# Altium schematic sheet W5500.SchDoc
size A3; SheetNumber: 3; SheetTotal: 8
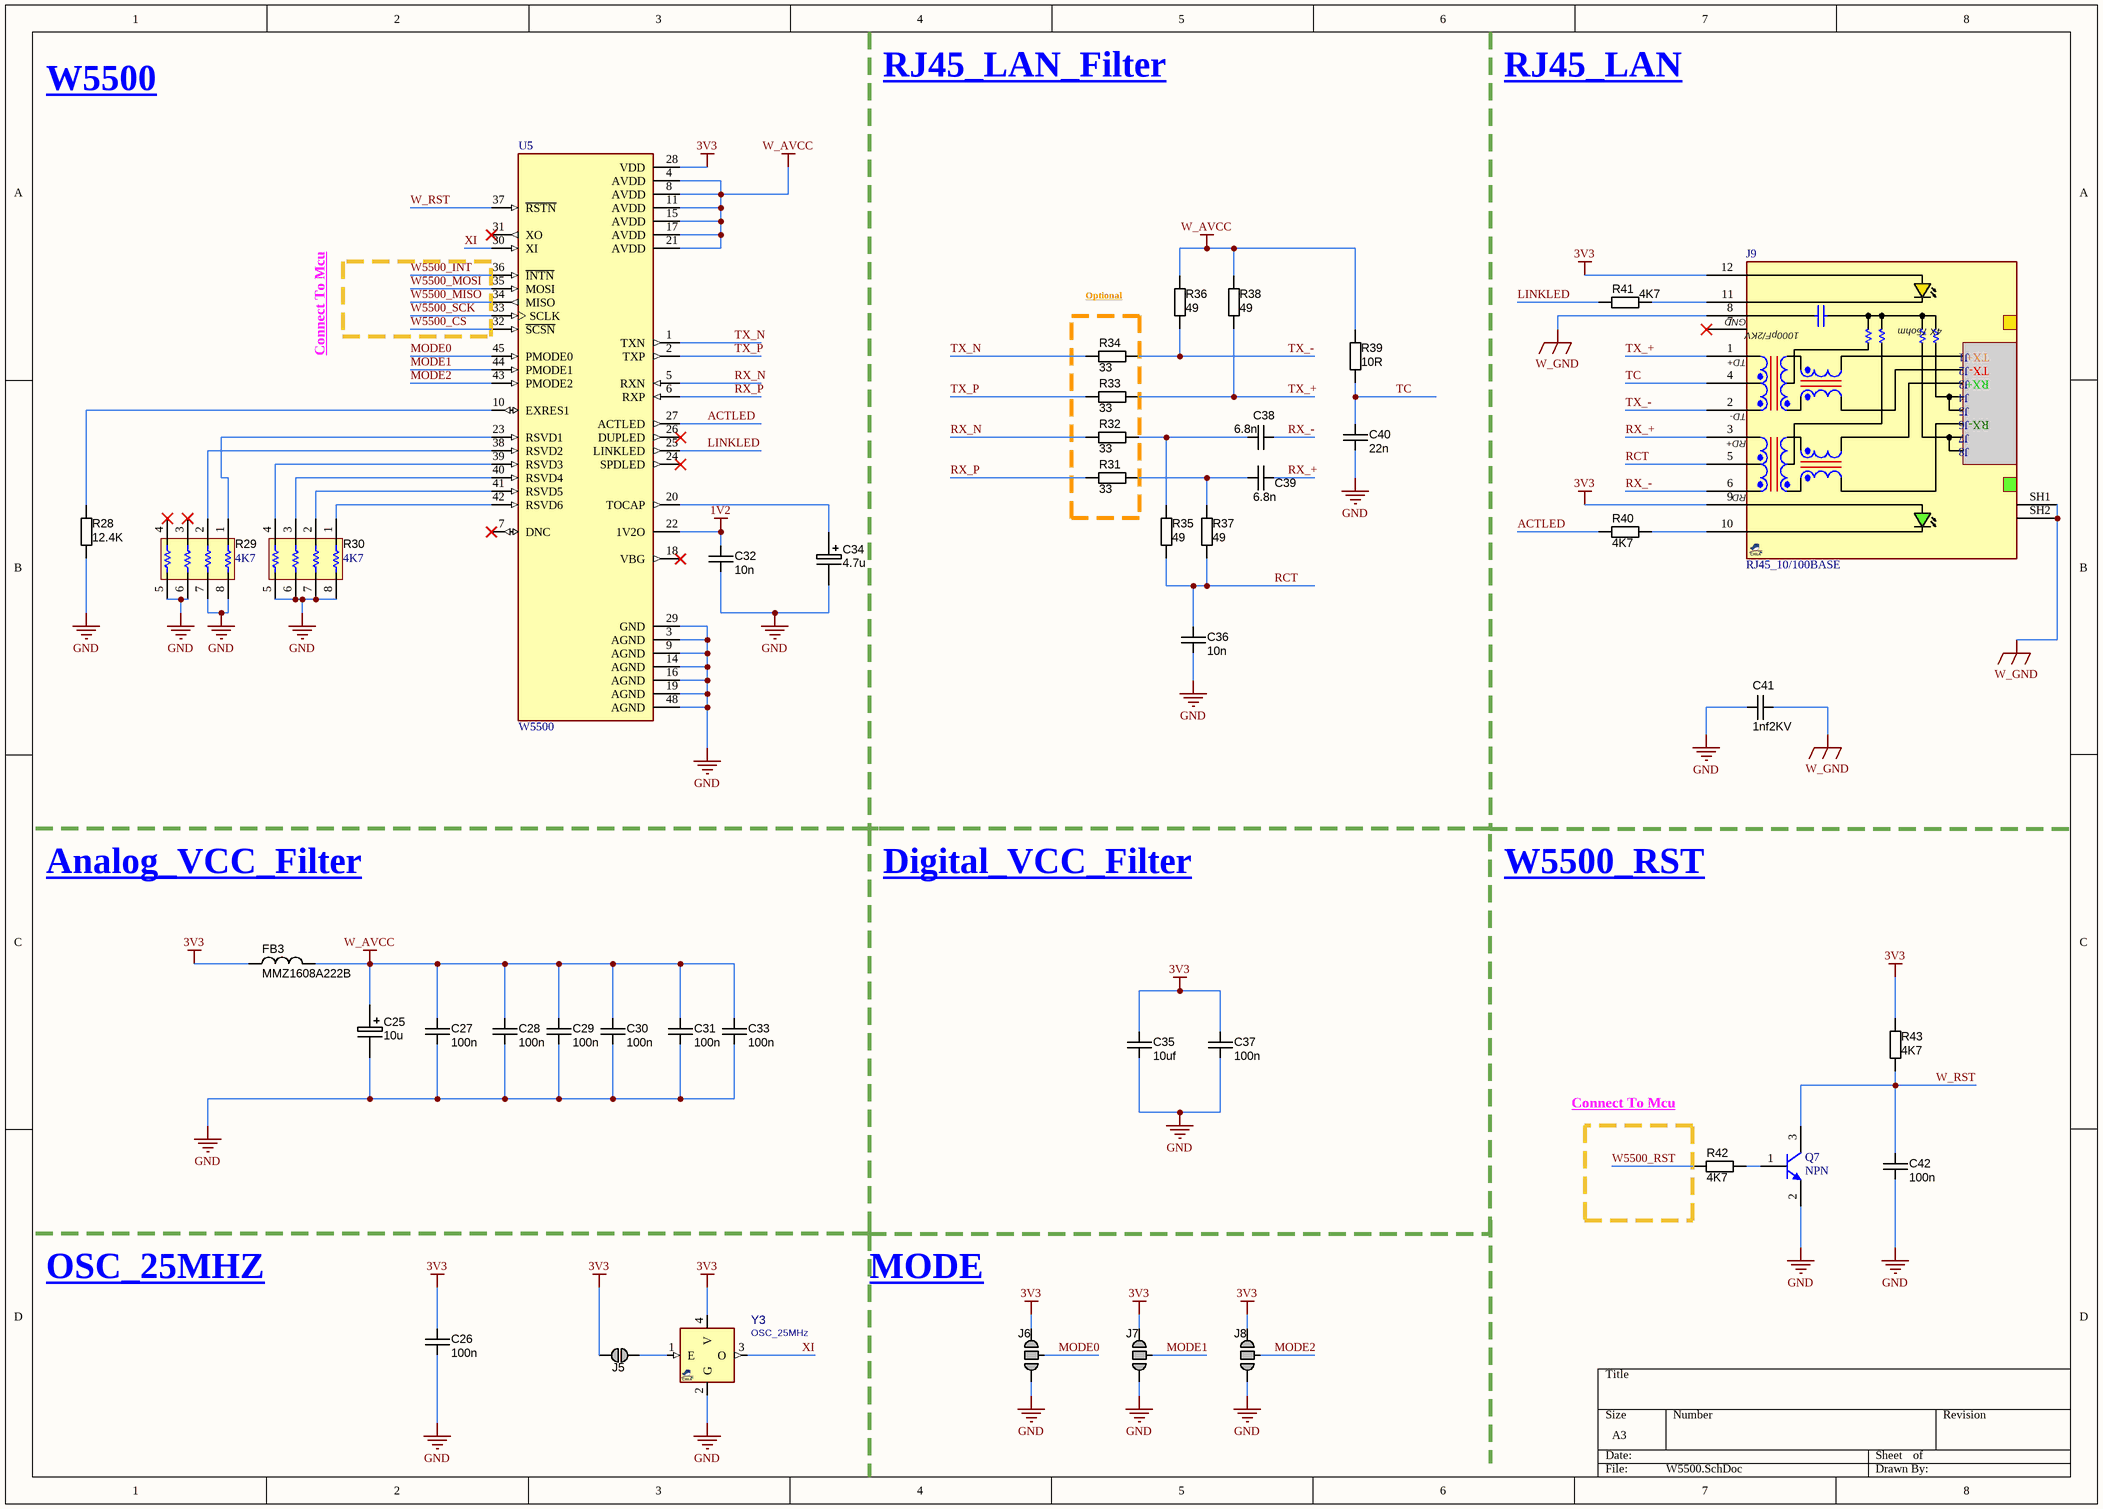
[diagram p0: W5500.SchDoc]

## Parts
C25  value 10u  [C_TN_3216]
C26  value 100n  [CAPC1608X90N]  (hidden comment: approved sub OK)
C27  value 100n  [CAPC1608X90N]  (hidden comment: approved sub OK)
C28  value 100n  [CAPC1608X90N]  (hidden comment: approved sub OK)
C29  value 100n  [CAPC1608X90N]  (hidden comment: approved sub OK)
C30  value 100n  [CAPC1608X90N]  (hidden comment: approved sub OK)
C31  value 100n  [CAPC1608X90N]  (hidden comment: approved sub OK)
C32  value 10n  [CAPC1608X90N]  (hidden comment: approved sub OK)
C33  value 100n  [CAPC1608X90N]  (hidden comment: approved sub OK)
C34  value 4.7u  [C_TN_3216]
C35  value 10uf  [CAPC1608X90N]  (hidden comment: approved sub OK)
C36  value 10n  [CAPC1608X90N]  (hidden comment: approved sub OK)
C37  value 100n  [CAPC1608X90N]  (hidden comment: approved sub OK)
C38  value 6.8n  [CAPC1608X90N]  (hidden comment: approved sub OK)
C39  value 6.8n  [CAPC1608X90N]  (hidden comment: approved sub OK)
C40  value 22n  [CAPC1608X90N]  (hidden comment: approved sub OK)
C41  value 1nf2KV  [C1206]  (hidden comment: approved sub OK)
C42  value 100n  [CAPC1608X90N]  (hidden comment: approved sub OK)
FB3  Manufacturer Part Number 1: MMZ1608A222B  [FBC1608X95N]  (hidden comment: 2K2 @ 100 MHz)
J5  Jumper  [JUMP1]  (value not drawn)  (no BOM)
J6  Jumper  [Jump_3Way]  (value not drawn)  (no BOM)
J7  Jumper  [Jump_3Way]  (value not drawn)  (no BOM)
J8  Jumper  [Jump_3Way]  (value not drawn)  (no BOM)
J9  RJ45_10/100BASE  [RJ45_8M_HR911105A]
Q7  NPN  [SOT23-3]
R28  value 12.4K  [RESC1608X55N]  (hidden comment: Thick Film)
R29  value 4K7  [RP0603X4]  (hidden comment: Resistor Array SMD)
R30  value 4K7  [RP0603X4]  (hidden comment: Resistor Array SMD)
R31  value 33  [RESC1608X55N]  (hidden comment: Thick Film)
R32  value 33  [RESC1608X55N]  (hidden comment: Thick Film)
R33  value 33  [RESC1608X55N]  (hidden comment: Thick Film)
R34  value 33  [RESC1608X55N]  (hidden comment: Thick Film)
R35  value 49  [RESC1608X55N]  (hidden comment: Thick Film)
R36  value 49  [RESC1608X55N]  (hidden comment: Thick Film)
R37  value 49  [RESC1608X55N]  (hidden comment: Thick Film)
R38  value 49  [RESC1608X55N]  (hidden comment: Thick Film)
R39  value 10R  [RESC1608X55N]  (hidden comment: Thick Film)
R40  value 4K7  [RESC1608X55N]  (hidden comment: Thick Film)
R41  value 4K7  [RESC1608X55N]  (hidden comment: Thick Film)
R42  value 4K7  [RESC1608X55N]  (hidden comment: Thick Film)
R43  value 4K7  [RESC1608X55N]  (hidden comment: Thick Film)
U5  W5500  [LQFP-48_N]
Y3  OSC_25MHz  [XTL_4_2520]

## Blocks framed on the sheet
Optional: R31-R34

## Nets
1V2: C32.1 U5.22(1V2O)
3V3: C26.1 C35.1 C37.1 FB3.1 J5.2 J6.3 J7.3 J8.3 J9.9(GLED+) J9.12(YLED+) R43.1 U5.28(VDD) Y3.4(V)
GND: C25.2 C26.2 C27.2 C28.2 C29.2 C30.2 C31.2 C32.2 C33.2 C34.2 C35.2 C36.2 C37.2 C40.2 C41.1 C42.2 J6.1 J7.1 J8.1 Q7.2(E) R28.1 R29.5 R29.6 R29.7 R29.8 R30.5 R30.6 R30.7 R30.8 U5.3(AGND) U5.9(AGND) U5.14(AGND) U5.16(AGND) U5.19(AGND) U5.29(GND) U5.48(AGND) Y3.2(G)
W_AVCC: C25.1 C27.1 C28.1 C29.1 C30.1 C31.1 C33.1 FB3.2 R36.2 R38.2 R39.2 U5.4(AVDD) U5.8(AVDD) U5.11(AVDD) U5.15(AVDD) U5.17(AVDD) U5.21(AVDD)
W_GND: C41.2 J9.8(CHSGND) J9.SH1 J9.SH2
ACTLED: R40.1 U5.27(ACTLED)
LINKLED: R41.1 U5.25(LINKLED)
MODE0: J6.2 U5.45(PMODE0)
MODE1: J7.2 U5.44(PMODE1)
MODE2: J8.2 U5.43(PMODE2)
RCT: C36.1 J9.5(RCT) R35.1 R37.1
RX_+: C39.2 J9.3(RD+)
RX_-: C38.2 J9.6(RD-)
RX_N: R32.1 U5.5(RXN)
RX_P: R31.1 U5.6(RXP)
TC: C40.1 J9.4(TCT) R39.1
TX_+: J9.1(TD+) R33.2 R38.1
TX_-: J9.2(TD-) R34.2 R36.1
TX_N: R34.1 U5.1(TXN)
TX_P: R33.1 U5.2(TXP)
W5500_CS: U5.32(~{SCSN})
W5500_INT: U5.36(~{INTN})
W5500_MISO: U5.34(MISO)
W5500_MOSI: U5.35(MOSI)
W5500_RST: R42.1
W5500_SCK: U5.33(SCLK)
W_RST: C42.1 Q7.3(C) R43.2 U5.37(~{RSTN})
XI: U5.30(XI) Y3.3(O)
NetC34_1: C34.1 U5.20(TOCAP)
NetC38_1: C38.1 R32.2 R35.2
NetC39_1: C39.1 R31.2 R37.2
NetJ5_1: J5.1 Y3.1(E)
NetJ9_10: J9.10(GLED-) R40.2
NetJ9_11: J9.11(YLED-) R41.2
NetQ7_1: Q7.1(B) R42.2
NetR28_2: R28.2 U5.10(EXRES1)
NetR29_1: R29.1 U5.23(RSVD1)
NetR29_2: R29.2 U5.38(RSVD2)
NetR30_1: R30.1 U5.42(RSVD6)
NetR30_2: R30.2 U5.41(RSVD5)
NetR30_3: R30.3 U5.40(RSVD4)
NetR30_4: R30.4 U5.39(RSVD3)

Not connected (* = marked no-connect by the designer): J9 7(NC)*; R29 3* 4*; U5 7(DNC)* 18(VBG)* 24(SPDLED)* 26(DUPLED)* 31(XO)*

## Notes on the sheet
- W5500
- RJ45_LAN_Filter
- RJ45_LAN
- Connect To Mcu
- Analog_VCC_Filter
- Digital_VCC_Filter
- W5500_RST
- OSC_25MHZ
- MODE
- (in symbol RJ45_HR911105A) GND; 4X 75ohm; 1000pF/2KV; J1; TX+; J2; TX-; J3; RX+; J4; J5; J6; RX-; J7; J8

## Library data of the parts
C25 = CAPT_4u7_3216_16V: Capacitor SMD Tantalum 10uF 10% 16V 3216-18; Manufacturer 1: Vishay/Sprague; Manufacturer Part Number 1: 293D475X9016A2TE3; SCDType: undef; Package / Case: EIA 535BAAC size A; Ratings: 16V; Tolerance: ±10%; Material: Tantalum; Supplier 1: Digi-Key; Supplier Part Number 1: 718-1148-1-ND
C26-C31 C33 C35-C37 C40 C42 = CAPC_100n_0603_X7R_50V_10%: Capacitor SMD Cer 100nF 10% 50V X7R 0603; Manufacturer 1: AVX Corporation; Manufacturer Part Number 1: 06035C104KAT2A; Ratings: 50V; X7R; Material: ceramic; SCDType: spec; Manufacturer 2: TDK Corporation; Manufacturer Part Number 2: C1608X7R1H104K; Package / Case: 0603 (1608 Metric); Tolerance: ±10%; Supplier 1: Digi-Key; Supplier Part Number 1: 478-5052-1-ND; ComponentLink1URL: http://www.avx.com/docs/Catalogs/cx7r.pdf; ComponentLink1Description: http://www.avx.com/docs/Catalogs/cx7r.pdf; Supplier 2: Digi-Key; Supplier Part Number 2: 445-1314-1-ND; ComponentLink2URL: http://product.tdk.com/capacitor/mlcc/en/documents/mlcc_commercial_general_en.pdf; ComponentLink2Description: http://product.tdk.com/capacitor/mlcc/en/documents/mlcc_commercial_general_en.pdf
C32 = CAPC_100n_0603_X7R_50V_10%: Capacitor SMD Cer 10nF 10% 50V X7R 0603; Manufacturer 1: AVX Corporation; Manufacturer Part Number 1: 06035C104KAT2A; Ratings: 50V; X7R; Material: ceramic; SCDType: spec; Manufacturer 2: TDK Corporation; Manufacturer Part Number 2: C1608X7R1H104K; Package / Case: 0603 (1608 Metric); Tolerance: ±10%; Supplier 1: Digi-Key; Supplier Part Number 1: 478-5052-1-ND; ComponentLink1URL: http://www.avx.com/docs/Catalogs/cx7r.pdf; ComponentLink1Description: http://www.avx.com/docs/Catalogs/cx7r.pdf; Supplier 2: Digi-Key; Supplier Part Number 2: 445-1314-1-ND; ComponentLink2URL: http://product.tdk.com/capacitor/mlcc/en/documents/mlcc_commercial_general_en.pdf; ComponentLink2Description: http://product.tdk.com/capacitor/mlcc/en/documents/mlcc_commercial_general_en.pdf
C34 = CAPT_4u7_3216_16V: Capacitor SMD Tantalum 4.7uF 10% 16V 3216-18; Manufacturer 1: Vishay/Sprague; Manufacturer Part Number 1: 293D475X9016A2TE3; SCDType: undef; Package / Case: EIA 535BAAC size A; Ratings: 16V; Tolerance: ±10%; Material: Tantalum; Supplier 1: Digi-Key; Supplier Part Number 1: 718-1148-1-ND
C38 = CAPC_100n_0603_X7R_50V_10%: Capacitor SMD Cer 6.8 10% 50V X7R 0603; Manufacturer 1: AVX Corporation; Manufacturer Part Number 1: 06035C104KAT2A; Ratings: 50V; X7R; Material: ceramic; SCDType: spec; Manufacturer 2: TDK Corporation; Manufacturer Part Number 2: C1608X7R1H104K; Package / Case: 0603 (1608 Metric); Tolerance: ±10%; Supplier 1: Digi-Key; Supplier Part Number 1: 478-5052-1-ND; ComponentLink1URL: http://www.avx.com/docs/Catalogs/cx7r.pdf; ComponentLink1Description: http://www.avx.com/docs/Catalogs/cx7r.pdf; Supplier 2: Digi-Key; Supplier Part Number 2: 445-1314-1-ND; ComponentLink2URL: http://product.tdk.com/capacitor/mlcc/en/documents/mlcc_commercial_general_en.pdf; ComponentLink2Description: http://product.tdk.com/capacitor/mlcc/en/documents/mlcc_commercial_general_en.pdf
C39 = CAPC_100n_0603_X7R_50V_10%: Capacitor SMD Cer 6.8nf 10% 50V X7R 0603; Manufacturer 1: AVX Corporation; Manufacturer Part Number 1: 06035C104KAT2A; Ratings: 50V; X7R; Material: ceramic; SCDType: spec; Manufacturer 2: TDK Corporation; Manufacturer Part Number 2: C1608X7R1H104K; Package / Case: 0603 (1608 Metric); Tolerance: ±10%; Supplier 1: Digi-Key; Supplier Part Number 1: 478-5052-1-ND; ComponentLink1URL: http://www.avx.com/docs/Catalogs/cx7r.pdf; ComponentLink1Description: http://www.avx.com/docs/Catalogs/cx7r.pdf; Supplier 2: Digi-Key; Supplier Part Number 2: 445-1314-1-ND; ComponentLink2URL: http://product.tdk.com/capacitor/mlcc/en/documents/mlcc_commercial_general_en.pdf; ComponentLink2Description: http://product.tdk.com/capacitor/mlcc/en/documents/mlcc_commercial_general_en.pdf
C41 = CAPC_100n_0603_X7R_50V_10%: Capacitor SMD Cer 1nF 10% 2kv X7R 0603; Manufacturer 1: AVX Corporation; Manufacturer Part Number 1: 06035C104KAT2A; Ratings: 50V; X7R; Material: ceramic; SCDType: spec; Manufacturer 2: TDK Corporation; Manufacturer Part Number 2: C1608X7R1H104K; Package / Case: 0603 (1608 Metric); Tolerance: ±10%; Supplier 1: Digi-Key; Supplier Part Number 1: 478-5052-1-ND; ComponentLink1URL: http://www.avx.com/docs/Catalogs/cx7r.pdf; ComponentLink1Description: http://www.avx.com/docs/Catalogs/cx7r.pdf; Supplier 2: Digi-Key; Supplier Part Number 2: 445-1314-1-ND; ComponentLink2URL: http://product.tdk.com/capacitor/mlcc/en/documents/mlcc_commercial_general_en.pdf; ComponentLink2Description: http://product.tdk.com/capacitor/mlcc/en/documents/mlcc_commercial_general_en.pdf
FB3 = FERRITE_2K2-100MHz_0603: Ferrite bead 2.2K Ohm at 100 MHz 200mA 0603 SMD; Manufacturer 1: TDK Corporation; Ratings: 200 mA; 800 mOhm DC; Impedance @ Frequency: 2200 Ohm @ 100MHz; DC Resistance (DCR): 800 mOhm Max; Filter Type: Differential Mode - Single; SCDType: source; Size / Dimension: 0.063" L x 0.031" W (1.60mm x 0.80mm); Current Rating: 200mA; Package / Case: 0603 (1608 Metric); Height (Max): 0.037" (0.95mm); Mounting Type: Surface Mount; Supplier 1: Digi-Key; Supplier Part Number 1: 445-8671-1-ND; RoHS 1: RoHS Compliant; ComponentLink1URL: http://www.tdk.co.jp/tefe02/e9412_mmz.pdf; ComponentLink1Description: http://www.tdk.co.jp/tefe02/e9412_mmz.pdf; Value: 2K2 @ 100 MHz
J5 = JUMP1: SMD jumper
J6-J8 = JUMP_3WAY: SMD jumper
J9 = RJ45_HR911105A: RJ45, 10/100BASE, G/Y LED; MANF: Hanrun; MANF_P#: HR911105A; PARAM2: 10/100BASE, G/Y LED; VALUE: RJ45_10/100BASE
Q7 = NPN: NPN Bipolar Transistor; Published: 8-Jun-2000; LatestRevisionDate: 17-Jul-2002; LatestRevisionNote: Re-released for DXP Platform.; PackageReference: TO-226-AA; Publisher: Altium Limited; PackageDescription: TO, Flat Index; 3 In-Line, Axial Leads; Body Dia. 4.8mm; Leads 0.55 x 0.51 mm (max); Code_JEDEC: TO-226-AA
R28 = RES_4K7_0603_5%: Resistor SMD chip 12.4K Ohm 0.1W 1% 0603; Manufacturer 1: Vishay/Dale; Manufacturer Part Number 1: CRCW06034K70JNEA; Ratings: 1/10 W; Tolerance: ±5%; SCDType: spec; Package / Case: 0603 (1608 metric); Material: Thick Film; Supplier 1: Digi-Key; Supplier Part Number 1: 541-4.7KGCT-ND
R31-R34 = RES_4K7_0603_5%: Resistor SMD chip 33 Ohm 0.1W 5% 0603; Manufacturer 1: Vishay/Dale; Manufacturer Part Number 1: CRCW06034K70JNEA; Ratings: 1/10 W; SCDType: spec; Package / Case: 0603 (1608 metric); Tolerance: ±5%; Material: Thick Film; Supplier 1: Digi-Key; Supplier Part Number 1: 541-4.7KGCT-ND
R35-R38 = RES_4K7_0603_5%: Resistor SMD chip 49 Ohm 0.1W 5% 0603; Manufacturer 1: Vishay/Dale; Manufacturer Part Number 1: CRCW06034K70JNEA; Ratings: 1/10 W; SCDType: spec; Package / Case: 0603 (1608 metric); Tolerance: ±5%; Material: Thick Film; Supplier 1: Digi-Key; Supplier Part Number 1: 541-4.7KGCT-ND
R39 = RES_4K7_0603_5%: Resistor SMD chip 10 Ohm 0.1W 5% 0603; Manufacturer 1: Vishay/Dale; Manufacturer Part Number 1: CRCW06034K70JNEA; Ratings: 1/10 W; SCDType: spec; Package / Case: 0603 (1608 metric); Tolerance: ±5%; Material: Thick Film; Supplier 1: Digi-Key; Supplier Part Number 1: 541-4.7KGCT-ND
R40-R43 = RES_4K7_0603_5%: Resistor SMD chip 4.7k Ohm 0.1W 5% 0603; Manufacturer 1: Vishay/Dale; Manufacturer Part Number 1: CRCW06034K70JNEA; Ratings: 1/10 W; SCDType: spec; Package / Case: 0603 (1608 metric); Tolerance: ±5%; Material: Thick Film; Supplier 1: Digi-Key; Supplier Part Number 1: 541-4.7KGCT-ND
U5 = W5500: Socket Contact Silver 17-20 AWG Crimp Power; MF: WIZnet; Price: None; Package: LQFP-48 WIZnet; Value: *; MP: W5500; Availability: Unavailable; SnapEDA_Link: https://www.snapeda.com/parts/W5500/WIZnet/view-part/45250/?ref=snap
Y3 = OSC_4_25MHz_3225E: CLOCK OSCILLATOR, 25MHz, 10PPM, 3.2X2.5mm; MANF: ECS; PARAM: 10PPM, 15pF, -40~85oC; DESC: DESCRIPTION; DIST#: MOUSER; PARAM2: 1.8~3.3V; MANF_P#: ECS-3225S18-250-FN-TR; ASSEMBLY: ASSEMBLY; PRICE: 1= 1.2$; Value: OSC_25MHz
R29 R30 = Resistor Array SMD: DatasheetVersion: 2021; ComponentLink1Description: Website Smart World; ComponentLink1URL: https://www.smartw.ir/; ComponentLink2Description: Telegram; ComponentLink2URL: https://t.me/altium_smartw; ComponentLink3Description: Instagram; ComponentLink3URL: https://Instagram.com/smartgw.ir